# EAGLE design pihat_rs485_pwr (EAGLE 8.3.2)
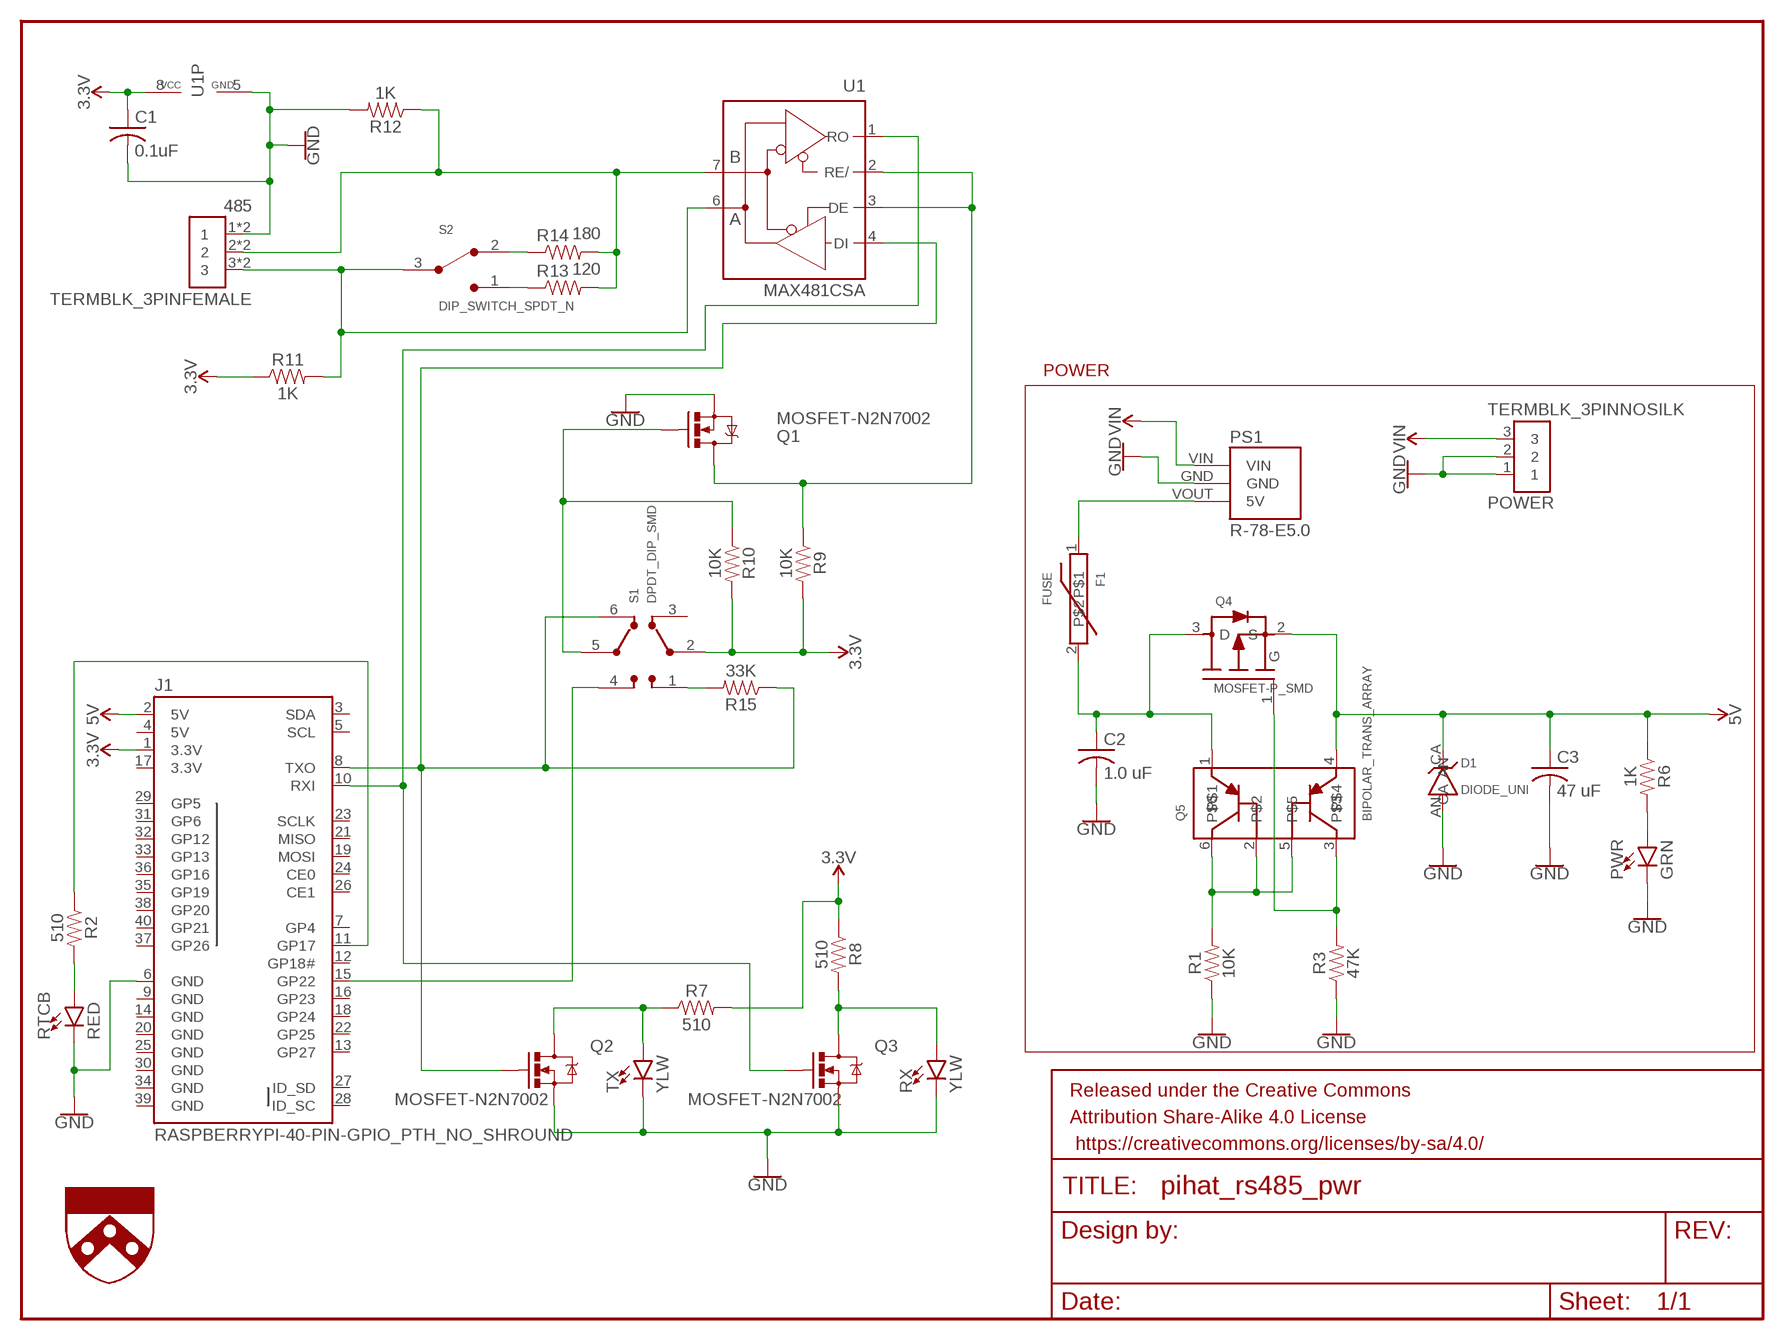
[diagram p0: schematic, sheet 1]

## Parts
485  TERMBLK_3PINFEMALE  [TERMBLK_FEMALE_3PIN_90_NOSILK]
C1  0.1uF  C-USC0603  [C0603]
C2  1.0 uF  C-USC0603  [C0603]
C3  47 uF  C-USC0603  [C0603]
D1  DIODE_UNI  [DO-214AA_UNI]
F1  FUSE  [1812_STD_BI]
FRAME1  FRAME-LETTERNO_PACKAGE  [DUMMY]
J1  RASPBERRYPI-40-PIN-GPIO_PTH_NO_SHROUND  [PI_2X20]
POWER  TERMBLK_3PINNOSILK  [TERMBLK_3PIN_90_NOSILK]
PS1  R-78-E5.0  [R-78-EXX]
PWR  GRN  LED0603  [LED-0603]
Q1  MOSFET-N2N7002  [SOT23-3]
Q2  MOSFET-N2N7002  [SOT23-3]
Q3  MOSFET-N2N7002  [SOT23-3]
Q4  MOSFET-P_SMD  [SOT23-3]
Q5  BIPOLAR_TRANS_ARRAY  [SOT363]
R1  10K  RESISTOR0603  [0603]
R2  510  RESISTOR0603  [0603]
R3  47K  RESISTOR0603  [0603]
R6  1K  RESISTOR0603  [0603]
R7  510  RESISTOR0603  [0603]
R8  510  RESISTOR0603  [0603]
R9  10K  RESISTOR0603  [0603]
R10  10K  RESISTOR0603  [0603]
R11  1K  RESISTOR0603  [0603]
R12  1K  RESISTOR0603  [0603]
R13  120  RESISTOR0603  [0603]
R14  180  RESISTOR0603  [0603]
R15  33K  RESISTOR0603  [0603]
RTCB  RED  LED0603  [LED-0603]
RX  YLW  LED0603  [LED-0603]
S1  DPDT_DIP_SMD  [DPDT_DIP_SMD]
S2  DIP_SWITCH_SPDT_N  [SINGLE_DIP_SW_NEUT]
TX  YLW  LED0603  [LED-0603]
U1  MAX481CSA  [SO08]
U$4  UPENN_SHIELD_.3_SILK  [UPENN_SHIELD_3_SILK]

## Nets
3.3V: C1.1 J1.1(3.3V) R7.2 R8.1 R9.2 R10.2 R11.1 S1.2(<2) U1.8(VCC)
5V: C3.1 D1.CA J1.2(5V) Q4.2(S) Q5.4 R6.1
GND: 485.1 485.4 C1.2 C2.2 C3.2 D1.AN J1.6(GND) POWER.1 POWER.2 PS1.GND PWR.C Q1.2(S) Q2.2(S) Q3.2(S) R1.1 R3.1 R12.2 RTCB.C RX.C TX.C U1.5(GND)
N$1: R14.1 S2.2
N$2: J1.15(GP22) S1.4(4>)
N$3: J1.8(TXO) Q2.1(G) R15.1 S1.6(6>) U1.4(DI)
N$4: Q5.2 Q5.5 Q5.6 R1.2
N$5: Q4.1(G) Q5.3 R3.2
N$7: C2.1 F1.2 Q4.3(D) Q5.1
N$8: F1.1 PS1.VOUT(5V)
N$12: R13.1 S2.1
N$13: 485.2 485.5 R12.1 R13.2 R14.2 U1.7(B)
N$14: PWR.A R6.2
N$15: R15.2 S1.1(<1)
N$16: J1.10(RXI) Q3.1(G) U1.1(RO)
N$20: R2.2 RTCB.A
N$22: J1.11(GP17) R2.1
N$25: 485.3 485.6 R11.2 S2.3 U1.6(A)
N$26: Q1.1(G) R10.1 S1.5(5>)
N$27: Q1.3(D) R9.1 U1.2(RE/) U1.3(DE)
N$28: Q3.3(D) R8.2 RX.A
N$29: Q2.3(D) R7.1 TX.A
VIN: POWER.3 PS1.VIN
Unconnected: J1.3(SDA) J1.5(SCL) J1.7(GP4) J1.12(GP18#) J1.13(GP27) J1.16(GP23) J1.18(GP24) J1.19(MOSI) J1.21(MISO) J1.22(GP25) J1.23(SCLK) J1.24(CE0) J1.26(CE1) J1.27(ID_SD) J1.28(ID_SC) J1.29(GP5) J1.31(GP6) J1.32(GP12) J1.33(GP13) J1.35(GP19) J1.36(GP16) J1.37(GP26) J1.38(GP20) J1.40(GP21) S1.3(<3)

## Notes on the sheet
- POWER

## Power pins joined to a net without a drawn wire
3.3V: J1.17(3.3V)
5V: J1.4(5V)
GND: J1.9(GND) J1.14(GND) J1.20(GND) J1.25(GND) J1.30(GND) J1.34(GND) J1.39(GND)

## Library data of the parts
485 POWER = UPenn:TERMBLK_3PIN
C1-C3 = resistor:C-US: CAPACITOR, American symbol
D1 = UPenn:DIODE_UNI
F1 = UPenn:FUSE
FRAME1 = SparkFun-Aesthetics:FRAME-LETTER: Schematic Frame - Letter Standard 8.5x11 US Letter frame; DESIGNER: Nobody; VERSION: v01
J1 = UPenn:RASPBERRYPI-40-PIN-GPIO
PS1 = UPenn:R-78-E5.0
PWR RTCB RX TX = SparkFun-LED:LED: LED (Generic) Standard schematic elements and footprints for 5mm, 3mm, 1206, and 0603 sized LEDs. Generic LEDs with no color specified.
Q1-Q3 = UPenn:MOSFET-N
Q4 = UPenn:MOSFET-P: P-Channel Mosfet
Q5 = UPenn:BIPOLAR_TRANS_ARRAY
R1-R3 R6-R15 = SparkFun-Resistors:RESISTOR: Generic Resistor Package
S1 = UPenn:DPDT_DIP_SMD
S2 = UPenn:DIP_SWITCH
U1 = maxim:MAX481CSA: RS485 TRANSEIVER; MF: MAXIM; MPN: MAX481CSA; OC_FARNELL: unknown; OC_NEWARK: 90C3817
U$4 = UPenn:UPENN_SHIELD

## Board
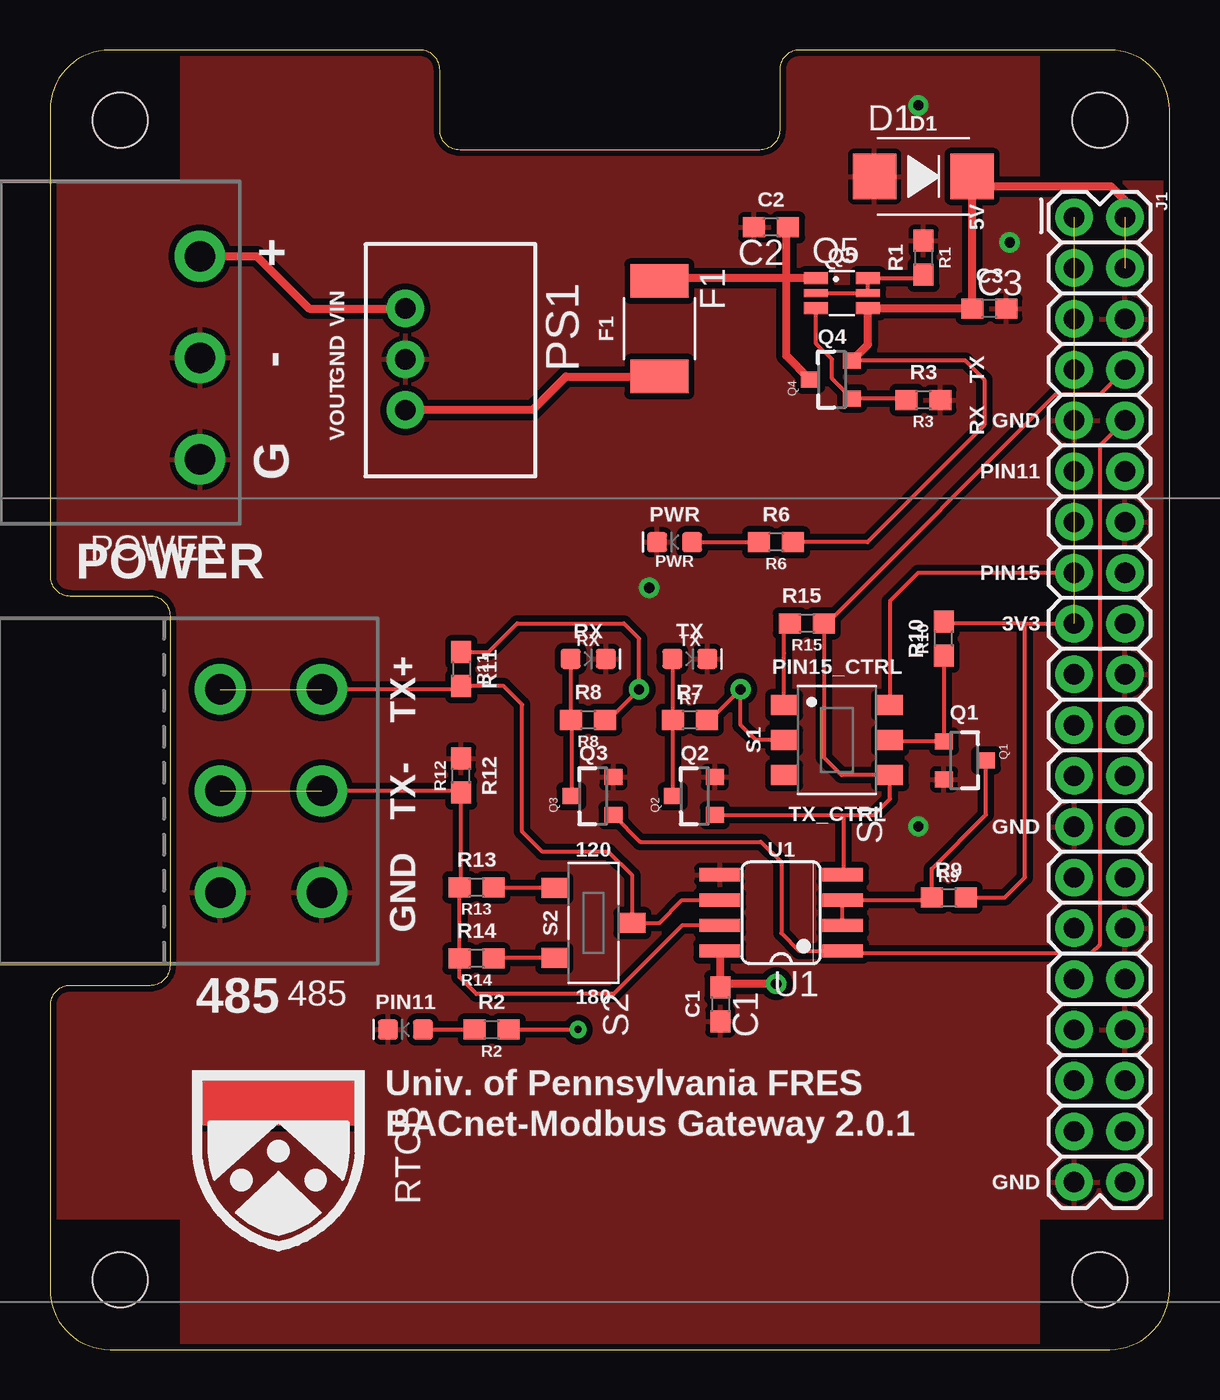
[diagram p1: board, top side]
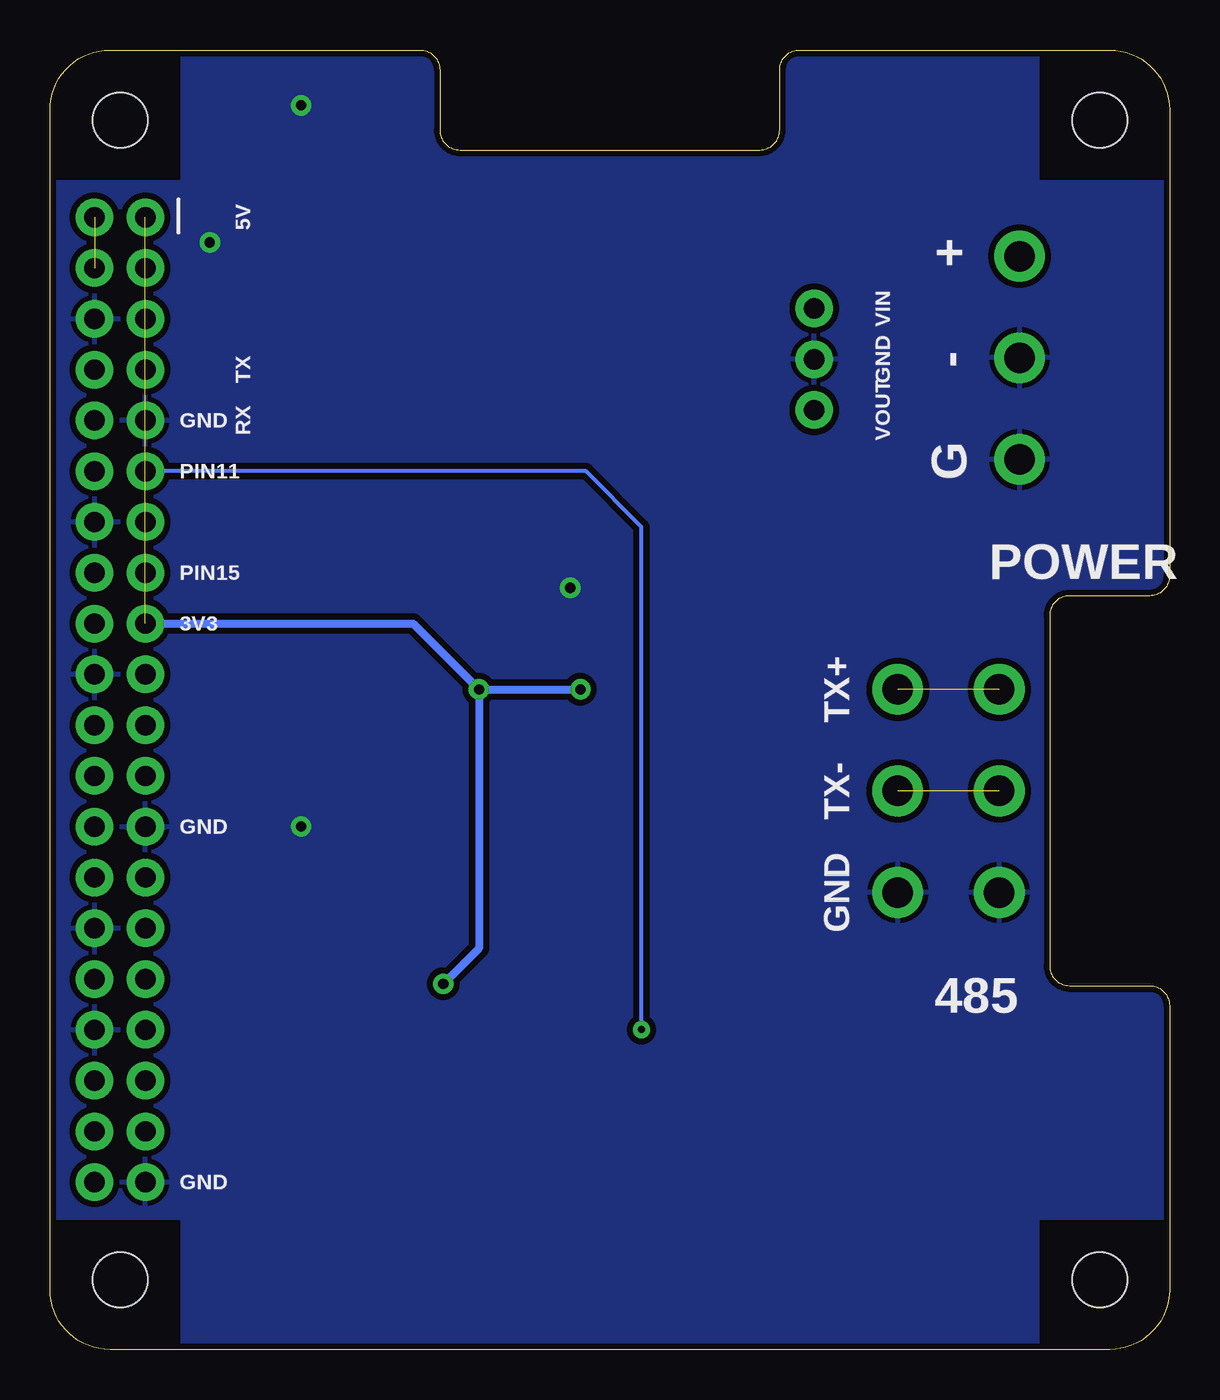
[diagram p2: board, bottom side, seen from below]

Size 56 x 65 mm. Coordinates in mm from the lower left corner, seen from the top.
Outline: 0,62 0,38.7 arc90 1,37.7 5,37.7 arc-90 6,36.7 6,19.2 arc-90 5,18.2 1,18.2 arc90 0,17.2 0,3 arc90 3,0 53,0 arc90 56,3 56,62 arc90 53,65 37.5,65 arc90 36.5,64 36.5,61 arc-90 35.5,60 20.5,60 arc-90 19.5,61 19.5,64 arc90 18.5,65 3,65 arc90 0,62
Copper layers (1*16): Top 0.035mm / dielectric 1.5mm / Bottom 0.035mm
Design rules "SparkFun": minimum track width 8mil, minimum drill 20mil, track to track 8mil, track to pad 8mil, pad to pad 8mil, via to via 8mil, smd to smd 8mil, copper to edge 8mil, drill to drill 8mil, minimum pad ring 12mil, minimum via ring 10mil, stop-mask expansion 4mil, vias tented up to drill 20mil, thermal gap 10mil
Holes 2.75 mm at 3.5,61.5 52.5,61.5 3.5,3.5 52.5,3.5

### Footprints (pad centres in the part's own frame; a part is rotated, then mirrored left to right if it is on the bottom)
TERMBLK_FEMALE_3PIN_90_NOSILK = drill 1.524 pad 2.54: 1 -5.08,0; 2 0,0; 3 5.08,0; 4 -5.08,5.08; 5 0,5.08; 6 5.08,5.08
C0603 = smd 1.1 x 1: 1 -0.85,0; 2 0.85,0
DO-214AA_UNI = smd 2.159 x 2.261: AN -2.438,0; CA 2.438,0
1812_STD_BI = smd 1.676 x 2.896: 1 2.388,0; 2 -2.388,0
PI_2X20 = drill 1.016 pad 1.88: 1 -24.13,-1.27; 2 -24.13,1.27; 3 -21.59,-1.27; 4 -21.59,1.27; 5 -19.05,-1.27; 6 -19.05,1.27; 7 -16.51,-1.27; 8 -16.51,1.27; 9 -13.97,-1.27; 10 -13.97,1.27; 11 -11.43,-1.27; 12 -11.43,1.27; 13 -8.89,-1.27; 14 -8.89,1.27; 15 -6.35,-1.27; 16 -6.35,1.27; 17 -3.81,-1.27; 18 -3.81,1.27; 19 -1.27,-1.27; 20 -1.27,1.27; 21 1.27,-1.27; 22 1.27,1.27; 23 3.81,-1.27; 24 3.81,1.27; 25 6.35,-1.27; 26 6.35,1.27; 27 8.89,-1.27; 28 8.89,1.27; 29 11.43,-1.27; 30 11.43,1.27; 31 13.97,-1.27; 32 13.97,1.27; 33 16.51,-1.27; 34 16.51,1.27; 35 19.05,-1.27; 36 19.05,1.27; 37 21.59,-1.27; 38 21.59,1.27; 39 24.13,-1.27; 40 24.13,1.27
TERMBLK_3PIN_90_NOSILK = drill 1.524 pad 2.54: 1 -5.08,0; 2 0,0; 3 5.08,0
R-78-EXX = drill 1.016 pad 1.88: GND 0,0; VIN -2.54,0; VOUT 2.54,0
LED-0603 = smd 1 x 1: A -0.877,0; C 0.877,0
SOT23-3 = smd 0.8 x 0.9: 1 -0.95,-1; 2 0.95,-1; 3 0,1.1
SOT363 = smd 1.2 x 0.6: 1 -1.3,0.75; 3 -1.3,-0.75; 4 1.3,-0.75; 6 1.3,0.75 | smd 1.2 x 0.4: 2 -1.3,0; 5 1.3,0
0603 = smd 1.1 x 1: 1 -0.85,0; 2 0.85,0
DPDT_DIP_SMD = smd 1 x 1.3: 1 -1.75,-2.65; 2 0,-2.65; 3 1.75,-2.65; 4 -1.75,2.65; 5 0,2.65; 6 1.75,2.65
SINGLE_DIP_SW_NEUT = smd 1 x 1.3: 1 -1.75,-1.95; 2 1.75,-1.95; 3 0,1.95
SO08 = smd 0.66 x 2.032: 1 -1.905,-3.073; 2 -0.635,-3.073; 3 0.635,-3.073; 4 1.905,-3.073; 5 1.905,3.073; 6 0.635,3.073; 7 -0.635,3.073; 8 -1.905,3.073

### Placement (x,y rotation side)
485  13.6,27.94 90 top
C1  33.53,17.27 270 top
C2  36.07,56.13 180 top
C3  46.99,52.07 0 top
D1  43.69,58.67 0 top
F1  30.48,51.05 270 top
FRAME1  0,46.99 0 top
J1  52.5,32.5 270 top
POWER  7.5,49.6 90 top
PS1  17.78,49.53 270 top
PWR  31.24,40.39 180 top
Q1  45.72,29.46 270 top
Q2  32.26,27.69 90 top
Q3  27.18,27.69 90 top
Q4  39.12,48.51 90 top
Q5  39.62,52.83 0 top
R1  43.69,54.61 270 top
R2  22.1,16 180 top
R3  43.69,47.5 180 top
R6  36.32,40.39 180 top
R7  32,31.5 0 top
R8  26.92,31.5 180 top
R9  44.96,22.61 0 top
R10  44.7,35.56 90 top
R11  20.57,34.04 270 top
R12  20.57,28.7 90 top
R13  21.34,23.11 180 top
R14  21.34,19.56 180 top
R15  37.86,36.32 180 top
RTCB  17.78,16 180 top
RX  26.92,34.54 0 top
S1  39.37,30.48 270 top
S2  27.18,21.34 270 top
TX  32,34.54 0 top
U1  36.58,21.84 90 top
U$4  7.62,13.46 0 top

### Tracks (layer width: path | path; a pad name or v marks a point on that pad's centre or on a via)
3.3V  (via drill 0.51)  (1 unrouted)
  Top 0.203: R8.1 27.94,31.5 v29.46,33.02 29.46,35.56 28.7,36.32 23.37,36.32 21.93,34.89 R11.1 | R7.2 33.02,31.5 v34.54,33.02 34.54,31.24 35.31,30.48 S1.2 | 33.53,19.91 U1.8 | 33.36,18.29 C1.1 | 48.77,36.31 J1.17 | 48.77,36.31 44.8,36.31 R10.2 | R9.2 47.75,22.61 48.77,23.62 48.77,36.31
  Top 0.406: C1.1 33.53,19.91 | v36.32,18.29 33.36,18.29
  Bottom 0.406: J1.17 37.83,36.31 v34.54,33.02 | v34.54,33.02 v29.46,33.02 | v34.54,33.02 34.54,20.07 v36.32,18.29
5V  (1 unrouted)
  Top 0.203: Q4.2 45.79,49.46 46.74,48.51 46.74,46.23 40.89,40.39 R6.1
  Top 0.406: J1.2 53.77,57.48 53.09,58.17 46.63,58.17 D1.CA C3.1 46.13,52.08 Q5.4 40.92,50.27 Q4.2
GND  (via drill 0.51)
  other vias: 43.43,26.16 43.43,62.23 48.01,55.37 29.97,38.1
  pour Top (isolate 0.305): 6.6,6.6 0,6.6 0,58.4 6.6,58.4 6.6,65 19.5,65 19.5,60 36.5,60 36.5,65 49.4,65 49.4,58.4 56,58.4 56,6.6 49.4,6.6 49.4,0 6.6,0
  pour Bottom (isolate 0.305): 6.6,6.6 0,6.6 0,58.4 6.6,58.4 6.6,65 19.5,65 19.5,60 36.5,60 36.5,65 49.4,65 49.4,58.4 56,58.4 56,6.6 49.4,6.6 49.4,0 6.6,0
N$1
  Top 0.203: S2.2 22.21,19.59 R14.1
N$2
  Top 0.203: S1.4 42.02,37.45 43.42,38.85 J1.15
N$3
  Top 0.203: J1.8 52.51,47.75 50.29,47.75 38.86,36.32 R15.1 38.71,29.61 39.6,28.73 S1.6 42.02,27.54 41.21,26.74 39.69,26.74 | Q2.1 39.69,26.74 | 39.69,26.74 39.69,23.94 U1.4
N$4
  Top 0.203: Q5.2 Q5.5 Q5.6 | Q5.6 41.04,53.59 | Q5.6 43.51,53.58 R1.2
N$5
  Top 0.203: R3.2 42.26,47.56 Q4.1 39.12,48.56 39.12,49.53 38.32,50.32 Q5.3
N$7
  Top 0.203: 30.62,53.58 F1.2
  Top 0.406: Q5.1 36.83,53.58 | 36.83,53.58 30.62,53.58 | Q4.3 36.83,49.7 36.83,53.58 | 36.83,53.58 36.83,56.05 C2.1
N$8
  Top 0.406: 30.33,48.51 F1.1 25.81,48.67 24.13,46.99 PS1.VOUT
N$12
  Top 0.203: S2.1 22.21,23.09 R13.1
N$13  (1 unrouted)
  Top 0.203: U1.7 31.62,21.21 28.19,17.78 21.34,17.78 20.49,18.63 R14.2 R13.2 20.57,23.2 R12.1 20.49,27.94 485.2
N$14
  Top 0.203: PWR.A R6.2
N$15
  Top 0.203: S1.1 36.72,34.29 36.72,34.84 36.72,36.28 R15.2
N$16
  Top 0.203: J1.10 52.5,45.2 52.5,20.24 52.07,19.81 39.78,19.81 U1.1 | Q3.1 29.51,25.4 35.56,25.4 36.58,24.38 36.58,20.83 37.47,19.94 U1.1 | U1.1 39.75,20.07
N$20
  Top 0.203: RTCB.A R2.2
N$22  (via drill 0.35)
  Top 0.203: R2.1 v26.42,16
  Bottom 0.203: v26.42,16 26.42,41.15 29.2,43.93 J1.11
N$25  (1 unrouted)
  Top 0.203: 29.25,21.21 S2.3 | S2.3 30.48,21.34 31.62,22.48 U1.6 | 485.3 20.41,33.02 R11.2 22.69,33.19 23.62,32.26 23.62,25.91 24.64,24.89 27.94,24.89 29.13,23.7 S2.3
N$26
  Top 0.203: S1.5 42.09,30.41 Q1.1 44.7,30.43 R10.1
N$27
  Top 0.203: U1.2 U1.3 43.98,22.48 R9.1 44.11,24.04 46.82,26.75 Q1.3
N$28
  Top 0.203: Q3.3 R8.2 26.05,31.52 RX.A
N$29
  Top 0.203: Q2.3 R7.1 31.15,34.52 TX.A
VIN
  Top 0.406: POWER.3 10.34,54.68 12.83,52.2 12.95,52.07 PS1.VIN

### Text on the board
tPlace: D1 | C2 | 5V | + | R1 | Q5 | C3 | VIN | F1 | - | GND | Q4 | R3 | TX | VOUT | RX | GND | G | PIN11 | PWR | R6 | POWER | PIN15 | R15 | RX | TX | R10 | 3V3 | R11 | PIN15_CTRL | TX+ | R8 | R7 | Q1 | S1 | R12 | Q3 | Q2 | TX- | TX_CTRL | GND | 120 | U1 | R13 | R9 | GND | R14 | S2 | 485 | 180 | PIN11 | R2 | C1 | Univ. of Pennsylvania FRES | BACnet-Modbus Gateway 2.0.1 | GND
bPlace: 5V | + | VIN | - | GND | TX | VOUT | RX | GND | G | PIN11 | POWER | PIN15 | 3V3 | TX+ | TX- | GND | GND | 485 | GND